# EasyEDA schematic SCH_SMD_FULL_2021-09-05.json
TITLE: Sheet_1; REV: 1.0; Date: 2021-08-26; Sheet: 1/1; Drawn By: Andreas Böhm; Company: Your Company
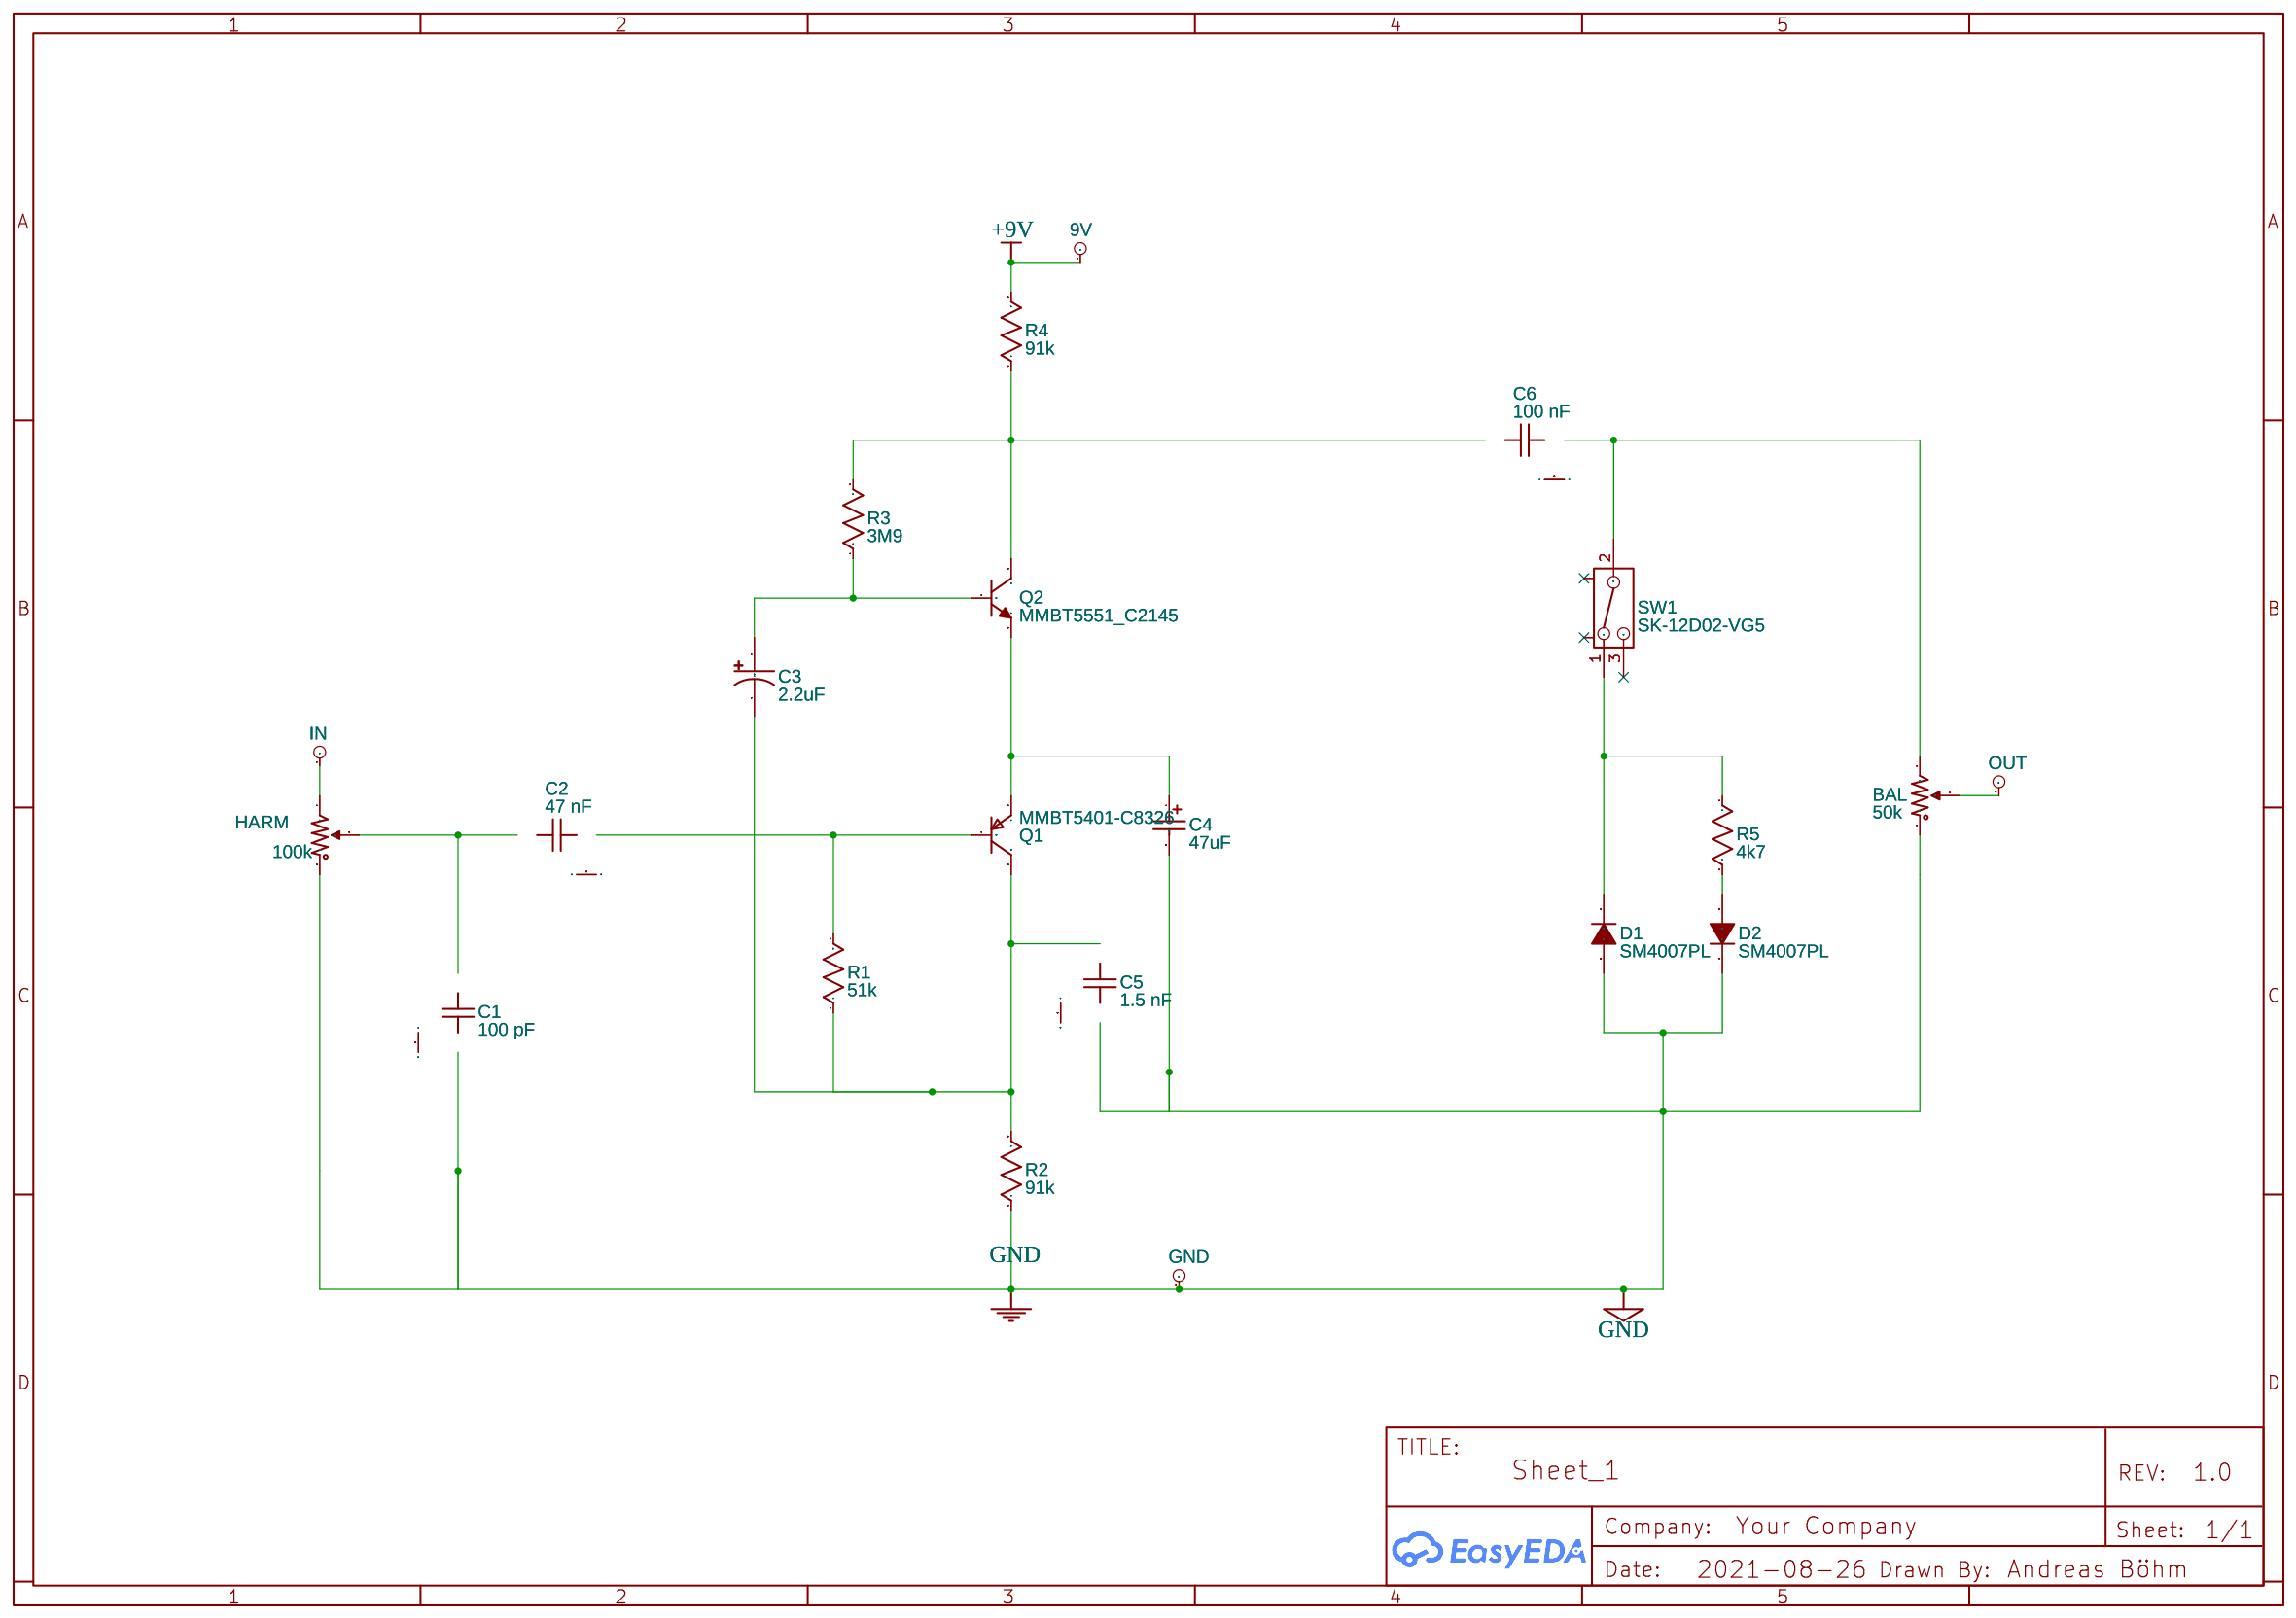
[diagram p0: schematic sheet]

## Parts
9V  9V  [PAD_TERMINAL-1.32MM_ROUND]
BAL  50k  [9MM ALPHA POT]
C1  100 pF  [C0603]
C2  47 nF  [C0603]
C3  2.2uF  [CAP-SMD_L3.5-W2.8-FD]
C4  47uF  [CAP-SMD_L6.0-W3.2-R-RD]
C5  1.5 nF  [C0603]
C6  100 nF  [C0603]
D1  SM4007PL  [SOD-123F_L2.8-W1.8-LS3.7-RD]
D2  SM4007PL  [SOD-123F_L2.8-W1.8-LS3.7-RD]
GND  GND  [PAD_TERMINAL-1.32MM_ROUND]
HARM  100k  [9MM ALPHA POT]
IN  IN  [PAD_TERMINAL-1.32MM_ROUND]
OUT  OUT  [PAD_TERMINAL-1.32MM_ROUND]
Q1  MMBT5401-C8326  [SOT-23-3_L2.9-W1.3-P1.90-LS2.4-BR]
Q2  MMBT5551_C2145  [SOT-23-3_L2.9-W1.3-P1.90-LS2.4-BR]
R1  51k  [R0603_NEW]
R2  91k  [R0603_NEW]
R3  3M9  [R0603_NEW]
R4  91k  [R0603_NEW]
R5  4k7  [R0603_NEW]
SW1  SK-12D02-VG5  [SPDT SWITCH]

## Library data of the parts
9V GND IN OUT = PAD_TERMINAL: Contributor: DangerousPrototype
BAL HARM = Potentiometer: K(%): 50; Manufacturer Part: ?
C1 C2 C5 C6 = Capacitor: Manufacturer Part: ?
C3 = 293D225X9025B2TE3: Supplier: LCSC; Supplier Part: C215887; Manufacturer: Vishay Intertech; Contributor: LCSC; JLCPCB Part Class: Extended Part
C4 = TAJC476K016RNJ: Supplier: LCSC; Manufacturer: AVX; Supplier Part: C7219; JLCPCB Part Class: Extended Part
D1 D2 = SM4007PL: Supplier: LCSC; Manufacturer: MDD; Supplier Part: C64898; JLCPCB Part Class: Basic Part
Q1 = MMBT5401-C8326: Supplier: LCSC; Manufacturer: CJ; Manufacturer Part: MMBT5401; Supplier Part: C8326; Contributor: 立创EDA官方封装库; JLCPCB Part Class: Basic Part
Q2 = MMBT5551_C2145: Supplier: LCSC; Manufacturer: CJ; Manufacturer Part: MMBT5551; Supplier Part: C2145; JLCPCB Part Class: Basic Part
R1-R5 = Resistor: Manufacturer Part: ?
SW1 = SK-12D02-VG5: Supplier: LCSC; Supplier Part: C136722; Manufacturer: Rectangular Connectors - Contacts; Contributor: LCSC

## Nets
+9V: 9V.P R4.2
GND: BAL.3 C1.1 C4.2 C5.1 D1.2(A) D2.1(C) GND.P HARM.3 R2.1
Net-(BAL-1): BAL.1 C6.1 SW1.2
Net-(BAL-2): BAL.2 OUT.P
Net-(C1-2): C1.2 C2.2 HARM.2
Net-(C2-1): C2.1 Q1.1(B) R1.2
Net-(C3-1): C3.1 Q2.1(B) R3.1
Net-(C3-2): C3.2 C5.2 Q1.3(C) R1.1 R2.2
Net-(C4-1): C4.1 Q1.2(E) Q2.2(E)
Net-(C6-2): C6.2 Q2.3(C) R3.2 R4.1
Net-(D1-1): D1.1(C) R5.1 SW1.1
Net-(D2-2): D2.2(A) R5.2
Net-(HARM-1): HARM.1 IN.P

Not connected (* = marked no-connect by the designer): SW1 * 3*
